# Altium schematic sheet RFM69HCW_Atmega328PB_Schematic.schdoc
size 385 x 160 mm
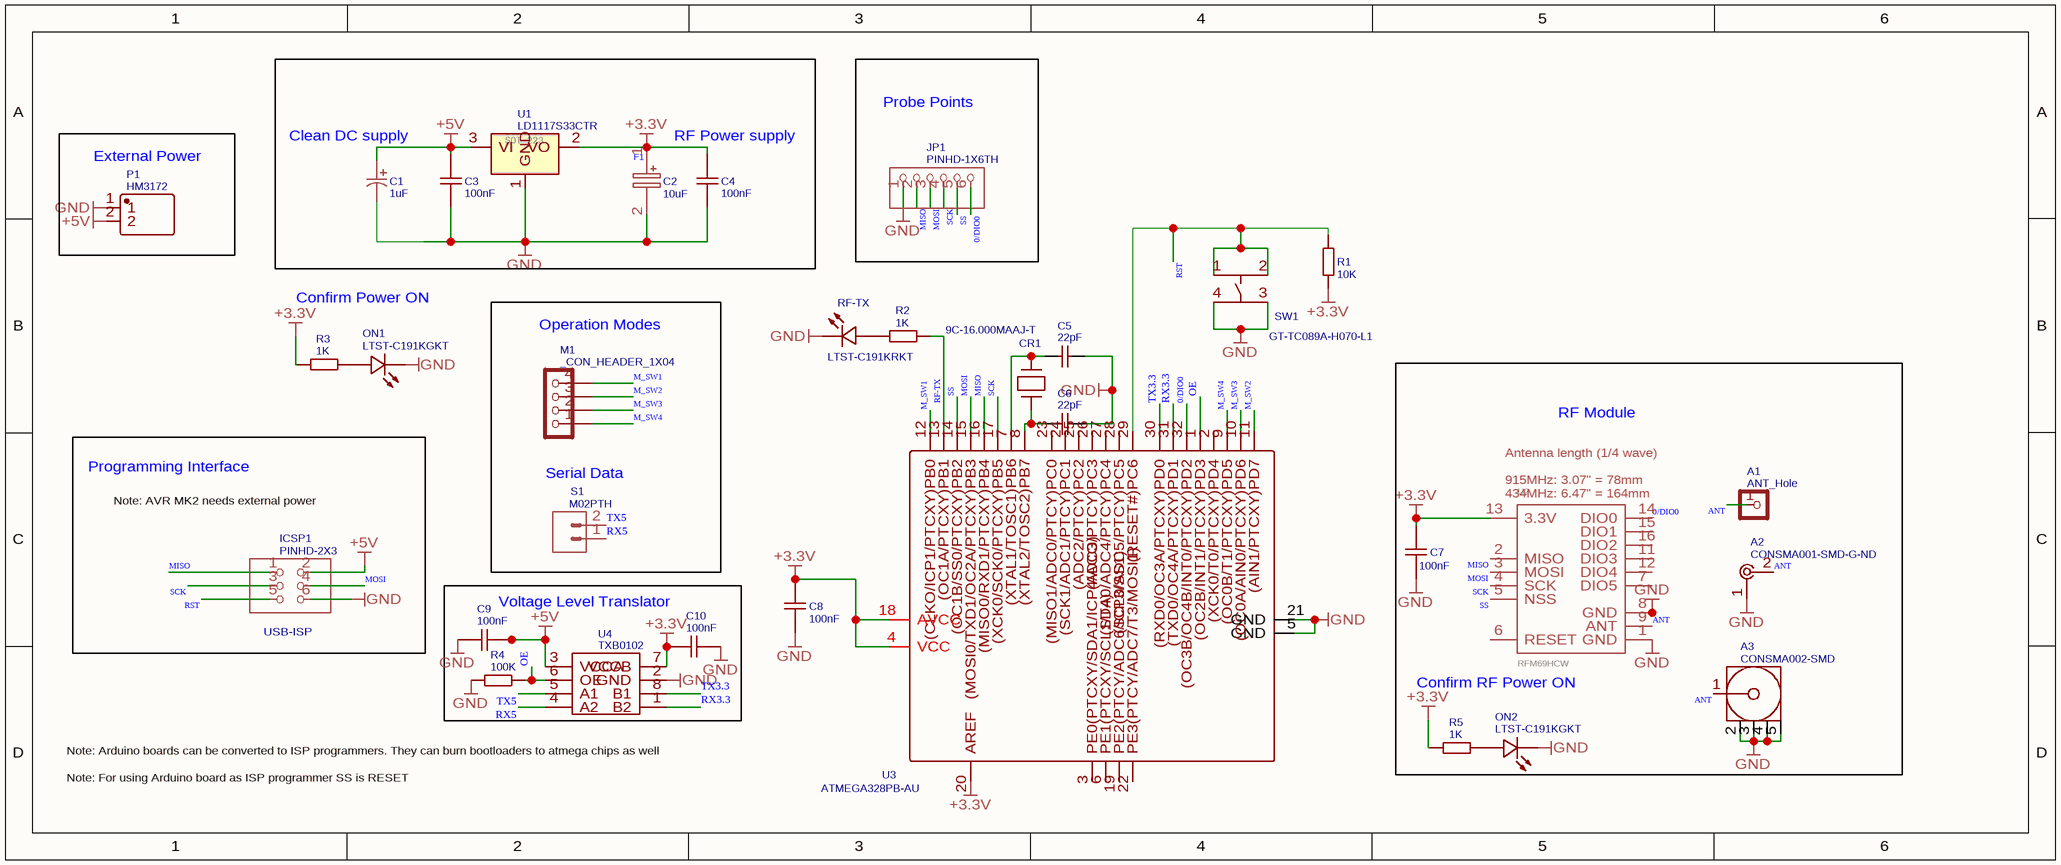
[diagram p0: RFM69HCW_Atmega328PB_Schematic.schdoc]

## Parts
A1  ANT_Hole  [M1X1]
A2  CONSMA001-SMD-G-ND  [RF_SMA_RECEPTICAL_VERTICAL_CONSMA001-SMD-G]
A3  CONSMA002-SMD  [CON-SMA-SMD-RA]
C1  1uF  [PCAP_4X5.4-ELECT_NCA]
C2  10uF  [UWT(4X5.4)]
C3  100nF  [C0603]
C4  100nF  [C0603]
C5  22pF  [C0603]
C6  22pF  [C0603]
C7  100nF  [C0603]
C8  100nF  [C0603]
C9  100nF  [C0603]
C10  100nF  [C0603]
CR1  9C-16.000MAAJ-T  [CRYSTAL_TXC_9C_TXC]
ICSP1  PINHD-2X3  [2X03]
JP1  PINHD-1X6TH  [1X06-TH]
M1  _CON_HEADER_1X04  [M1X4]
ON1  LTST-C191KGKT  [LED0603-RD]
ON2  LTST-C191KGKT  [LED0603-RD]
P1  HM3172  [ZH-1.5-2A]
R1  10K  [R0603]
R2  1K  [R0603]
R3  1K  [R0603]
R4  100K  [R0603]
R5  1K  [R0603]
RF-TX  LTST-C191KRKT  [LED0603-RD]
S1  M02PTH  [1X02]
SW1  GT-TC089A-H070-L1  [SW-SMD_4P-L6.0-W6.4-P4.50-LS8.6]
U1  LD1117S33CTR  [SOT-223]
U2  RFM69HCW  [RFM69HCW-XXXS2]
U3  ATMEGA328PB-AU  [TQFP-32_L7.0-W7.0-P0.80-LS9.0-BL]
U4  TXB0102  [US8]

## Blocks framed on the sheet
Probe Points: JP1
External Power: P1
Programming Interface: ICSP1
Voltage Level Translator: C9 C10 R4 U4

## Nets
+3.3V: C2.1(+) C4.2 C7.2 C8.2 C10.2 R1.1 R3.1 R5.1 U1.2(VO) U2.13(3.3V) U3.4(VCC) U3.18(AVCC) U3.20(AREF) U4.7(VCCB)
+5V: C1.1 C3.2 C9.2 ICSP1.2 P1.2 U1.3(VI) U4.3(VCCA)
GND: A2.1 A3.2(GND) A3.3(GND) A3.4(GND) A3.5(GND) C1.2 C2.2(-) C3.1 C4.1 C5.2 C6.2 C7.1 C8.1 C9.1 C10.1 ICSP1.6 JP1.1 ON1.1(-) ON2.1(-) P1.1 R4.2 RF-TX.1(-) SW1.3 SW1.4 U1.1(GND) U2.1(GND) U2.8(GND) U2.10(GND) U3.5(GND) U3.21(GND) U4.2(GND)
0/DIO0: JP1.6 U2.14(DIO0) U3.32((OC3B/OC4B/INT0/PTCXY)PD2)
ANT: A1.1 A2.2 A3.1(Signal) U2.9(ANT)
M_SW1: M1.4 U3.12((CLKO/ICP1/PTCXY)PB0)
M_SW2: M1.3 U3.11((AIN1/PTCXY)PD7)
M_SW3: M1.2 U3.10((OC0A/AIN0/PTCXY)PD6)
M_SW4: M1.1 U3.9((OC0B/T1/PTCXY)PD5)
MISO: ICSP1.1 JP1.2 U2.2(MISO) U3.16((MISO0/RXD1/PTCXY)PB4)
MOSI: ICSP1.4 JP1.3 U2.3(MOSI) U3.15((MOSI0/TXD1/OC2A/PTCXY)PB3)
OE: R4.1 U3.1((OC2B/INT1/PTCXY)PD3) U4.6(OE)
RF-TX: R2.2 U3.13((OC1A/PTCXY)PB1)
RST: ICSP1.5 R1.2 SW1.1 SW1.2 U3.29((RESET#)PC6)
RX3.3: U3.31((TXD0/OC4A/PTCXY)PD1) U4.1(B2)
RX5: S1.1 U4.4(A2)
SCK: ICSP1.3 JP1.4 U2.4(SCK) U3.17((XCK0/SCK0/PTCXY)PB5)
SS: JP1.5 U2.5(NSS) U3.14((OC1B/SS0/PTCXY)PB2)
TX3.3: U3.30((RXD0/OC3A/PTCXY)PD0) U4.8(B1)
TX5: S1.2 U4.5(A1)
NetC5_1: C5.1 CR1.2 U3.7((XTAL1/TOSC1)PB6)
NetC6_1: C6.1 CR1.1 U3.8((XTAL2/TOSC2)PB7)
NetON1_2: ON1.2(+) R3.2
NetON2_2: ON2.2(+) R5.2
NetR2_1: R2.1 RF-TX.2(+)

Not connected (* = marked no-connect by the designer): U2 6(RESET) 7(DIO5) 11(DIO3) 12(DIO4) 15(DIO1) 16(DIO2); U3 2((XCK0/T0/PTCXY)PD4) 3(PE0(PTCXY/SDA1/ICP4/ACO)) 6(PE1(PTCXY/SCL1/T4)) 19(PE2(PTCY/ADC6/ICP3/SS1)) 22(PE3(PTCY/ADC7/T3/MOSI1)) 23((MISO1/ADC0/PTCY)PC0) 24((SCK1/ADC1/PTCY)PC1) 25((ADC2/PTCY)PC2) 26((ADC3/PTCY)PC3) 27((SDA0/ADC4/PTCY)PC4) 28((SCL0/ADC5/PTCY)PC5)

## Notes on the sheet
- (near C1) Clean DC supply
- RF Power supply
- (near C2) F1
- Confirm Power ON
- (near M1) Operation Modes
- Serial Data
- (near U2) Antenna length (1/4 wave)
  915MHz: 3.07" = 78mm
  434MHz: 6.47" = 164mm
- RF Module
- Note: AVR MK2 needs external power
- (near ICSP1) USB-ISP
- Confirm RF Power ON
- (near U4) Note: Arduino boards can be converted to ISP programmers. They can burn bootloaders to atmega chips as well
- Note: For using Arduino board as ISP programmer SS is RESET
- (in symbol LD1117S33CTR) SOT-223

## Library data of the parts
A1 = ANT_Hole: Contributor: DangerousPrototype; spicePre: J; spiceSymbolName: CON_HEADER_1X01
A2 = CONSMA001-SMD-G-ND: Contributor: Ron Childress; spicePre: J; spiceSymbolName: CONSMA001-SMD-G-ND
A3 = CONSMA002-SMD: description: SMA Female Right Angle Surface Mount Connector; spicePre: J; spiceSymbolName: CONSMA002-SMD
C1 = 1uF: Contributor: tkowalski; spicePre: C; spiceSymbolName: UWX1H010MCL1GB
C2 = 10uF: Contributor: tmanabc123; spicePre: C; spiceSymbolName: UWT1C100MCL1GB
C3 C4 C7-C10 = 100nF: BOM_Manufacturer: KEMET; BOM_Manufacturer Part: C0603C104M5RAC7867; nameAlias: Capacitance; Contributor: LCSC; BOM_Supplier: LCSC; BOM_Supplier Part: C599655; spicePre: C; spiceSymbolName: C0603C104M5RAC7867_C599655
C5 C6 = 22pF: BOM_Manufacturer Part: CL10C220JB8NNNC; BOM_Manufacturer: SAMSUNG; nameAlias: Capacitance; SMT Type: Basic; BOM_Supplier: LCSC; BOM_Supplier Part: C1653; BOM_JLCPCB SMD: Yes; BOM_LCSC Assembly: Yes; spicePre: C; spiceSymbolName: CL10C220JB8NNNC
CR1 = 9C-16.000MAAJ-T: Contributor: Utsav Trivedi; spicePre: C; spiceSymbolName: 9C-16.000MAAJ-T
ICSP1 = PINHD-2X3: Contributor: Utsav Trivedi; spicePre: J; spiceSymbolName: PINHD-2X3
JP1 = PINHD-1X6TH: Contributor: Utsav Trivedi; spicePre: J; spiceSymbolName: PINHD-1X6TH
M1 = _CON_HEADER_1X04: Contributor: DangerousPrototype; spicePre: J; spiceSymbolName: _CON_HEADER_1X04
ON1 ON2 = LTST-C191KGKT: BOM_Manufacturer: LITEON; Contributor: LCSC; BOM_Supplier: LCSC; BOM_Manufacturer Part: LTST-C191KGKT; BOM_Supplier Part: C125098; spicePre: L; spiceSymbolName: LTST-C191KGKT
P1 = HM3172: BOM_Manufacturer: Boom Precision Elec; Contributor: EdoKuipers; BOM_Supplier: Jaycar; BOM_Supplier Part: HM3172; BOM_Manufacturer Part: -; link: https://www.jaycar.com.au/medias/sys_master/images/9224938782750/HM3172-2-way-pcb-mount-screw-terminals-5mm-pitchImageMain-515.jpg; spicePre: C; spiceSymbolName: HM3172
R1 = 10K: BOM_Manufacturer: ROHM Semicon; BOM_Manufacturer Part: MCR03ERTF1002; nameAlias: Resistance (Ohms); Contributor: LCSC; BOM_Supplier: LCSC; BOM_Supplier Part: C224640; spicePre: R; spiceSymbolName: MCR03ERTF1002
R2 R3 R5 = 1K: BOM_Manufacturer: PANASONIC; BOM_Manufacturer Part: ERJ-3EKF1001V; nameAlias: Resistance (Ohms); Contributor: LCSC; BOM_Supplier: LCSC; BOM_Supplier Part: C118155; spicePre: R; spiceSymbolName: ERJ-3EKF1001V
R4 = 100K: BOM_Manufacturer: YAGEO; BOM_Manufacturer Part: v; nameAlias: Resistance (Ohms); Contributor: LCSC; BOM_Supplier: LCSC; BOM_Supplier Part: C14675; spicePre: R; spiceSymbolName: RC0603FR-07100KL
RF-TX = LTST-C191KRKT: BOM_Manufacturer: LITEON; Contributor: LCSC; SMT Type: Extend; BOM_Supplier: LCSC; BOM_Manufacturer Part: LTST-C191KRKT; BOM_Supplier Part: C125099; BOM_JLCPCB SMD: Yes; spicePre: L; spiceSymbolName: LTST-C191KRKT
S1 = M02PTH: Contributor: Utsav Trivedi; spicePre: J; spiceSymbolName: M02PTH
SW1 = GT-TC089A-H070-L1: BOM_Manufacturer: G-Switch; Contributor: LCSC; BOM_Supplier: LCSC; BOM_Supplier Part: C778179; BOM_Manufacturer Part: GT-TC089A-H070-L1; spicePre: S; spiceSymbolName: GT-TC089A-H070-L1
U1 = LD1117S33CTR: Contributor: Philip Dale; spicePre: U; spiceSymbolName: LD1117S33CTR
U3 = ATMEGA328PB-AU: BOM_Manufacturer: MICROCHIP; Contributor: LCSC; SMT Type: Extend; BOM_Supplier: LCSC; BOM_Manufacturer Part: ATMEGA328PB-AU; BOM_Supplier Part: C132230; BOM_JLCPCB SMD: Yes; BOM_LCSC Assembly: Yes; spicePre: U; spiceSymbolName: ATMEGA328PB-AU
U4 = TXB0102: BOM_Manufacturer: Texas Instruments; BOM_Manufacturer Part: TXB0102DCUR; Contributor: Prince Bahoumina; spicePre: U; spiceSymbolName: TXB0102